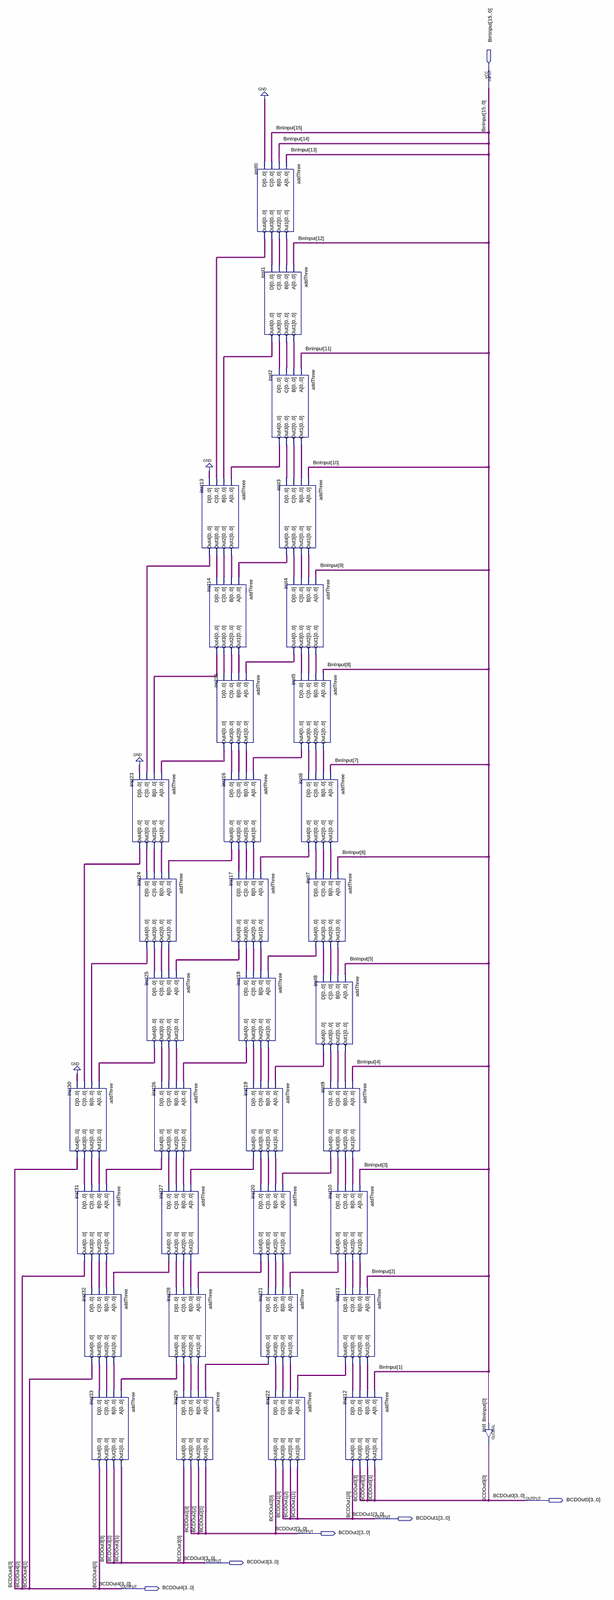
[diagram p0: schematic sheet, whole]
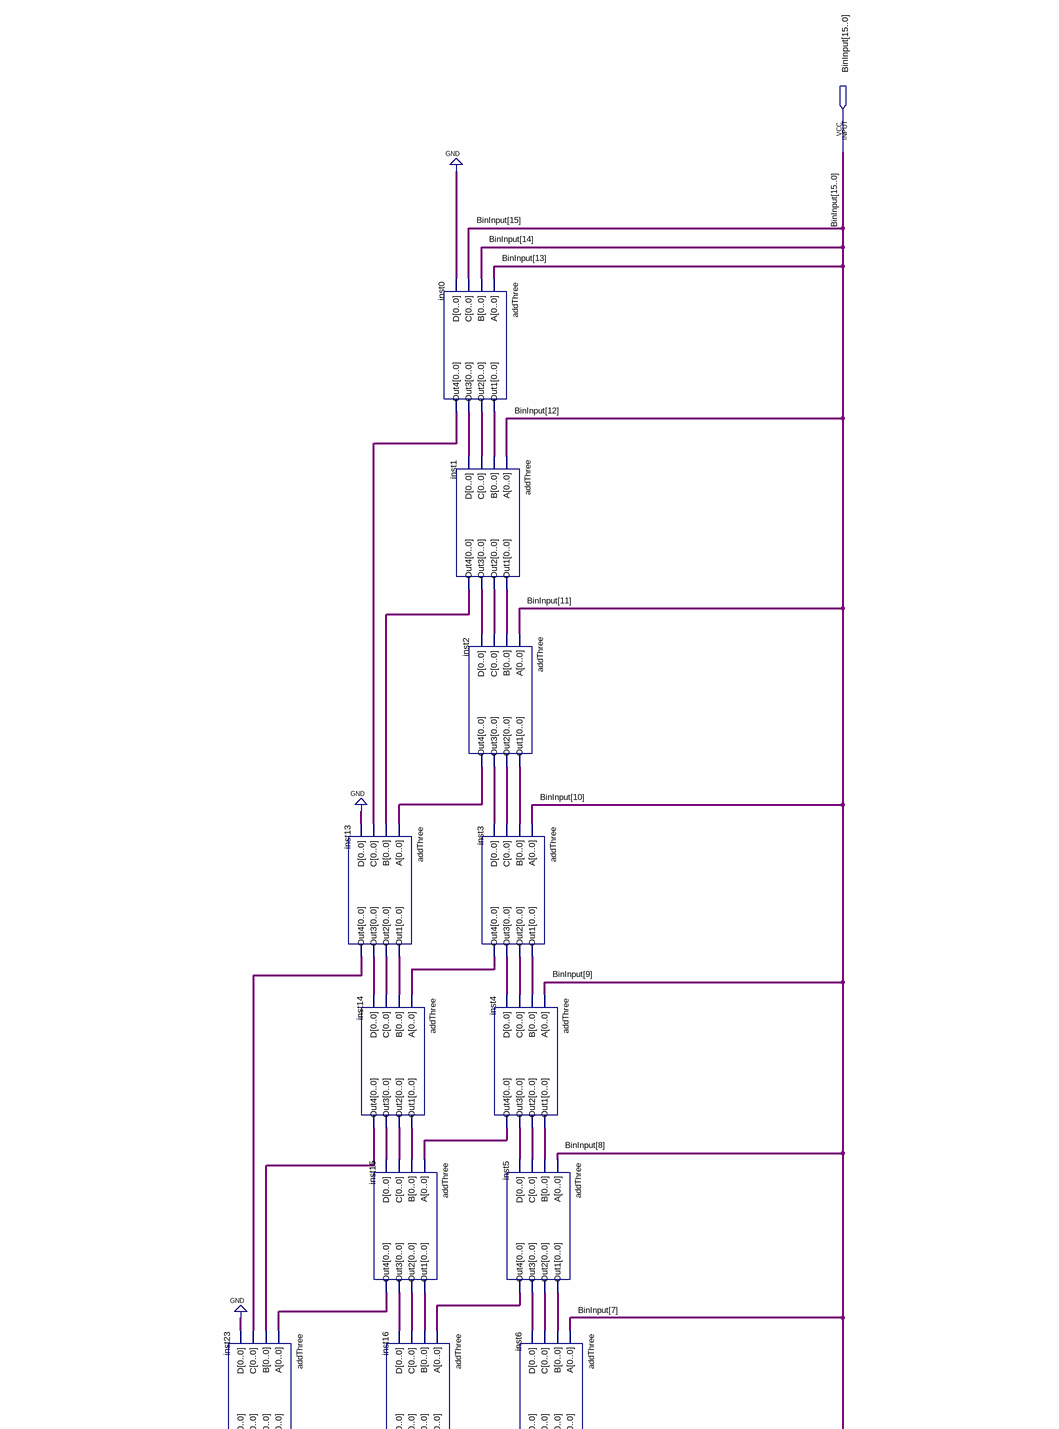
[diagram p1: schematic sheet, upper part]
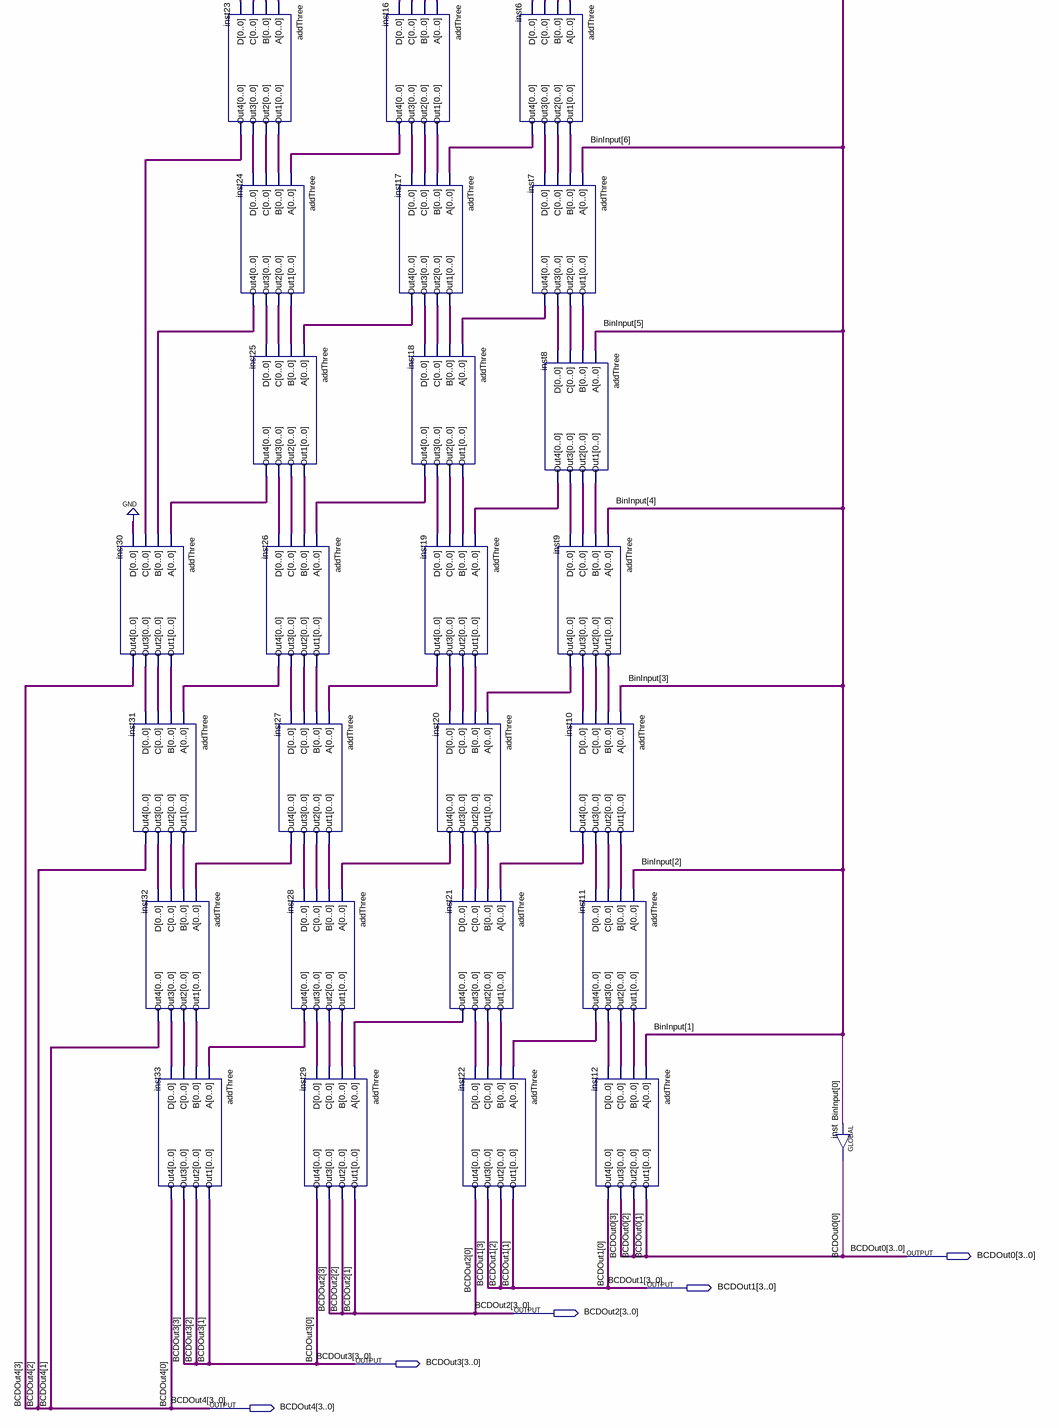
[diagram p2: schematic sheet, lower part]
// Quartus schematic binary_To_BCD.bdf as structural Verilog: 35 symbols, 6 pins
module binary_To_BCD (
  input  [15:0] BinInput,
  output [3:0] BCDOut0,
  output [3:0] BCDOut1,
  output [3:0] BCDOut2,
  output [3:0] BCDOut3,
  output [3:0] BCDOut4
);

  wire inst0_out1, inst0_out2, inst0_out3, inst0_out4, inst1_out1, inst1_out2, inst1_out3, inst1_out4,
       inst2_out1, inst2_out2, inst2_out3, inst2_out4, inst3_out1, inst3_out2, inst3_out3, inst3_out4,
       inst4_out1, inst4_out2, inst4_out3, inst4_out4, inst5_out1, inst5_out2, inst5_out3, inst5_out4,
       inst6_out1, inst6_out2, inst6_out3, inst6_out4, inst7_out1, inst7_out2, inst7_out3, inst7_out4,
       inst8_out1, inst8_out2, inst8_out3, inst8_out4, inst9_out1, inst9_out2, inst9_out3, inst9_out4,
       inst10_out1, inst10_out2, inst10_out3, inst10_out4, inst11_out1, inst11_out2, inst11_out3,
       inst11_out4, inst13_out1, inst13_out2, inst13_out3, inst13_out4, inst14_out1, inst14_out2,
       inst14_out3, inst14_out4, inst15_out1, inst15_out2, inst15_out3, inst15_out4, inst16_out1,
       inst16_out2, inst16_out3, inst16_out4, inst17_out1, inst17_out2, inst17_out3, inst17_out4,
       inst18_out1, inst18_out2, inst18_out3, inst18_out4, inst19_out1, inst19_out2, inst19_out3,
       inst19_out4, inst20_out1, inst20_out2, inst20_out3, inst20_out4, inst21_out1, inst21_out2,
       inst21_out3, inst21_out4, inst23_out1, inst23_out2, inst23_out3, inst23_out4, inst24_out1,
       inst24_out2, inst24_out3, inst24_out4, inst25_out1, inst25_out2, inst25_out3, inst25_out4,
       inst26_out1, inst26_out2, inst26_out3, inst26_out4, inst27_out1, inst27_out2, inst27_out3,
       inst27_out4, inst28_out1, inst28_out2, inst28_out3, inst28_out4, inst30_out1, inst30_out2,
       inst30_out3, inst31_out1, inst31_out2, inst31_out3, inst32_out1, inst32_out2, inst32_out3;

  addThree inst30 (
    .A(inst25_out4), .B(inst24_out4), .C(inst23_out4), .D(1'b0), .Out1(inst30_out1), .Out2(inst30_out2),
    .Out3(inst30_out3), .Out4(BCDOut4[3]));
  addThree inst31 (
    .A(inst26_out4), .B(inst30_out1), .C(inst30_out2), .D(inst30_out3), .Out1(inst31_out1),
    .Out2(inst31_out2), .Out3(inst31_out3), .Out4(BCDOut4[2]));
  addThree inst32 (
    .A(inst27_out4), .B(inst31_out1), .C(inst31_out2), .D(inst31_out3), .Out1(inst32_out1),
    .Out2(inst32_out2), .Out3(inst32_out3), .Out4(BCDOut4[1]));
  addThree inst33 (
    .A(inst28_out4), .B(inst32_out1), .C(inst32_out2), .D(inst32_out3), .Out1(BCDOut3[1]), .Out2(BCDOut3[2]),
    .Out3(BCDOut3[3]), .Out4(BCDOut4[0]));
  addThree inst23 (
    .A(inst15_out4), .B(inst14_out4), .C(inst13_out4), .D(1'b0), .Out1(inst23_out1), .Out2(inst23_out2),
    .Out3(inst23_out3), .Out4(inst23_out4));
  addThree inst24 (
    .A(inst16_out4), .B(inst23_out1), .C(inst23_out2), .D(inst23_out3), .Out1(inst24_out1),
    .Out2(inst24_out2), .Out3(inst24_out3), .Out4(inst24_out4));
  addThree inst25 (
    .A(inst17_out4), .B(inst24_out1), .C(inst24_out2), .D(inst24_out3), .Out1(inst25_out1),
    .Out2(inst25_out2), .Out3(inst25_out3), .Out4(inst25_out4));
  addThree inst26 (
    .A(inst18_out4), .B(inst25_out1), .C(inst25_out2), .D(inst25_out3), .Out1(inst26_out1),
    .Out2(inst26_out2), .Out3(inst26_out3), .Out4(inst26_out4));
  addThree inst27 (
    .A(inst19_out4), .B(inst26_out1), .C(inst26_out2), .D(inst26_out3), .Out1(inst27_out1),
    .Out2(inst27_out2), .Out3(inst27_out3), .Out4(inst27_out4));
  addThree inst28 (
    .A(inst20_out4), .B(inst27_out1), .C(inst27_out2), .D(inst27_out3), .Out1(inst28_out1),
    .Out2(inst28_out2), .Out3(inst28_out3), .Out4(inst28_out4));
  addThree inst29 (
    .A(inst21_out4), .B(inst28_out1), .C(inst28_out2), .D(inst28_out3), .Out1(BCDOut2[1]), .Out2(BCDOut2[2]),
    .Out3(BCDOut2[3]), .Out4(BCDOut3[0]));
  addThree inst13 (
    .A(inst2_out4), .B(inst1_out4), .C(inst0_out4), .D(1'b0), .Out1(inst13_out1), .Out2(inst13_out2),
    .Out3(inst13_out3), .Out4(inst13_out4));
  addThree inst14 (
    .A(inst3_out4), .B(inst13_out1), .C(inst13_out2), .D(inst13_out3), .Out1(inst14_out1),
    .Out2(inst14_out2), .Out3(inst14_out3), .Out4(inst14_out4));
  addThree inst15 (
    .A(inst4_out4), .B(inst14_out1), .C(inst14_out2), .D(inst14_out3), .Out1(inst15_out1),
    .Out2(inst15_out2), .Out3(inst15_out3), .Out4(inst15_out4));
  addThree inst16 (
    .A(inst5_out4), .B(inst15_out1), .C(inst15_out2), .D(inst15_out3), .Out1(inst16_out1),
    .Out2(inst16_out2), .Out3(inst16_out3), .Out4(inst16_out4));
  addThree inst17 (
    .A(inst6_out4), .B(inst16_out1), .C(inst16_out2), .D(inst16_out3), .Out1(inst17_out1),
    .Out2(inst17_out2), .Out3(inst17_out3), .Out4(inst17_out4));
  addThree inst18 (
    .A(inst7_out4), .B(inst17_out1), .C(inst17_out2), .D(inst17_out3), .Out1(inst18_out1),
    .Out2(inst18_out2), .Out3(inst18_out3), .Out4(inst18_out4));
  addThree inst19 (
    .A(inst8_out4), .B(inst18_out1), .C(inst18_out2), .D(inst18_out3), .Out1(inst19_out1),
    .Out2(inst19_out2), .Out3(inst19_out3), .Out4(inst19_out4));
  addThree inst20 (
    .A(inst9_out4), .B(inst19_out1), .C(inst19_out2), .D(inst19_out3), .Out1(inst20_out1),
    .Out2(inst20_out2), .Out3(inst20_out3), .Out4(inst20_out4));
  addThree inst0 (
    .A(BinInput[13]), .B(BinInput[14]), .C(BinInput[15]), .D(1'b0), .Out1(inst0_out1), .Out2(inst0_out2),
    .Out3(inst0_out3), .Out4(inst0_out4));
  addThree inst1 (
    .A(BinInput[12]), .B(inst0_out1), .C(inst0_out2), .D(inst0_out3), .Out1(inst1_out1), .Out2(inst1_out2),
    .Out3(inst1_out3), .Out4(inst1_out4));
  addThree inst2 (
    .A(BinInput[11]), .B(inst1_out1), .C(inst1_out2), .D(inst1_out3), .Out1(inst2_out1), .Out2(inst2_out2),
    .Out3(inst2_out3), .Out4(inst2_out4));
  addThree inst3 (
    .A(BinInput[10]), .B(inst2_out1), .C(inst2_out2), .D(inst2_out3), .Out1(inst3_out1), .Out2(inst3_out2),
    .Out3(inst3_out3), .Out4(inst3_out4));
  addThree inst21 (
    .A(inst10_out4), .B(inst20_out1), .C(inst20_out2), .D(inst20_out3), .Out1(inst21_out1),
    .Out2(inst21_out2), .Out3(inst21_out3), .Out4(inst21_out4));
  addThree inst22 (
    .A(inst11_out4), .B(inst21_out1), .C(inst21_out2), .D(inst21_out3), .Out1(BCDOut1[1]), .Out2(BCDOut1[2]),
    .Out3(BCDOut1[3]), .Out4(BCDOut2[0]));
  addThree inst4 (
    .A(BinInput[9]), .B(inst3_out1), .C(inst3_out2), .D(inst3_out3), .Out1(inst4_out1), .Out2(inst4_out2),
    .Out3(inst4_out3), .Out4(inst4_out4));
  addThree inst5 (
    .A(BinInput[8]), .B(inst4_out1), .C(inst4_out2), .D(inst4_out3), .Out1(inst5_out1), .Out2(inst5_out2),
    .Out3(inst5_out3), .Out4(inst5_out4));
  addThree inst6 (
    .A(BinInput[7]), .B(inst5_out1), .C(inst5_out2), .D(inst5_out3), .Out1(inst6_out1), .Out2(inst6_out2),
    .Out3(inst6_out3), .Out4(inst6_out4));
  addThree inst7 (
    .A(BinInput[6]), .B(inst6_out1), .C(inst6_out2), .D(inst6_out3), .Out1(inst7_out1), .Out2(inst7_out2),
    .Out3(inst7_out3), .Out4(inst7_out4));
  addThree inst8 (
    .A(BinInput[5]), .B(inst7_out1), .C(inst7_out2), .D(inst7_out3), .Out1(inst8_out1), .Out2(inst8_out2),
    .Out3(inst8_out3), .Out4(inst8_out4));
  addThree inst9 (
    .A(BinInput[4]), .B(inst8_out1), .C(inst8_out2), .D(inst8_out3), .Out1(inst9_out1), .Out2(inst9_out2),
    .Out3(inst9_out3), .Out4(inst9_out4));
  addThree inst10 (
    .A(BinInput[3]), .B(inst9_out1), .C(inst9_out2), .D(inst9_out3), .Out1(inst10_out1), .Out2(inst10_out2),
    .Out3(inst10_out3), .Out4(inst10_out4));
  addThree inst11 (
    .A(BinInput[2]), .B(inst10_out1), .C(inst10_out2), .D(inst10_out3), .Out1(inst11_out1),
    .Out2(inst11_out2), .Out3(inst11_out3), .Out4(inst11_out4));
  addThree inst12 (
    .A(BinInput[1]), .B(inst11_out1), .C(inst11_out2), .D(inst11_out3), .Out1(BCDOut0[1]), .Out2(BCDOut0[2]),
    .Out3(BCDOut0[3]), .Out4(BCDOut1[0]));
  GLOBAL inst (.IN(BinInput[0]), .OUT(BCDOut0[0]));
endmodule
